# EAGLE design M452x2015 (EAGLE 6.6.0)
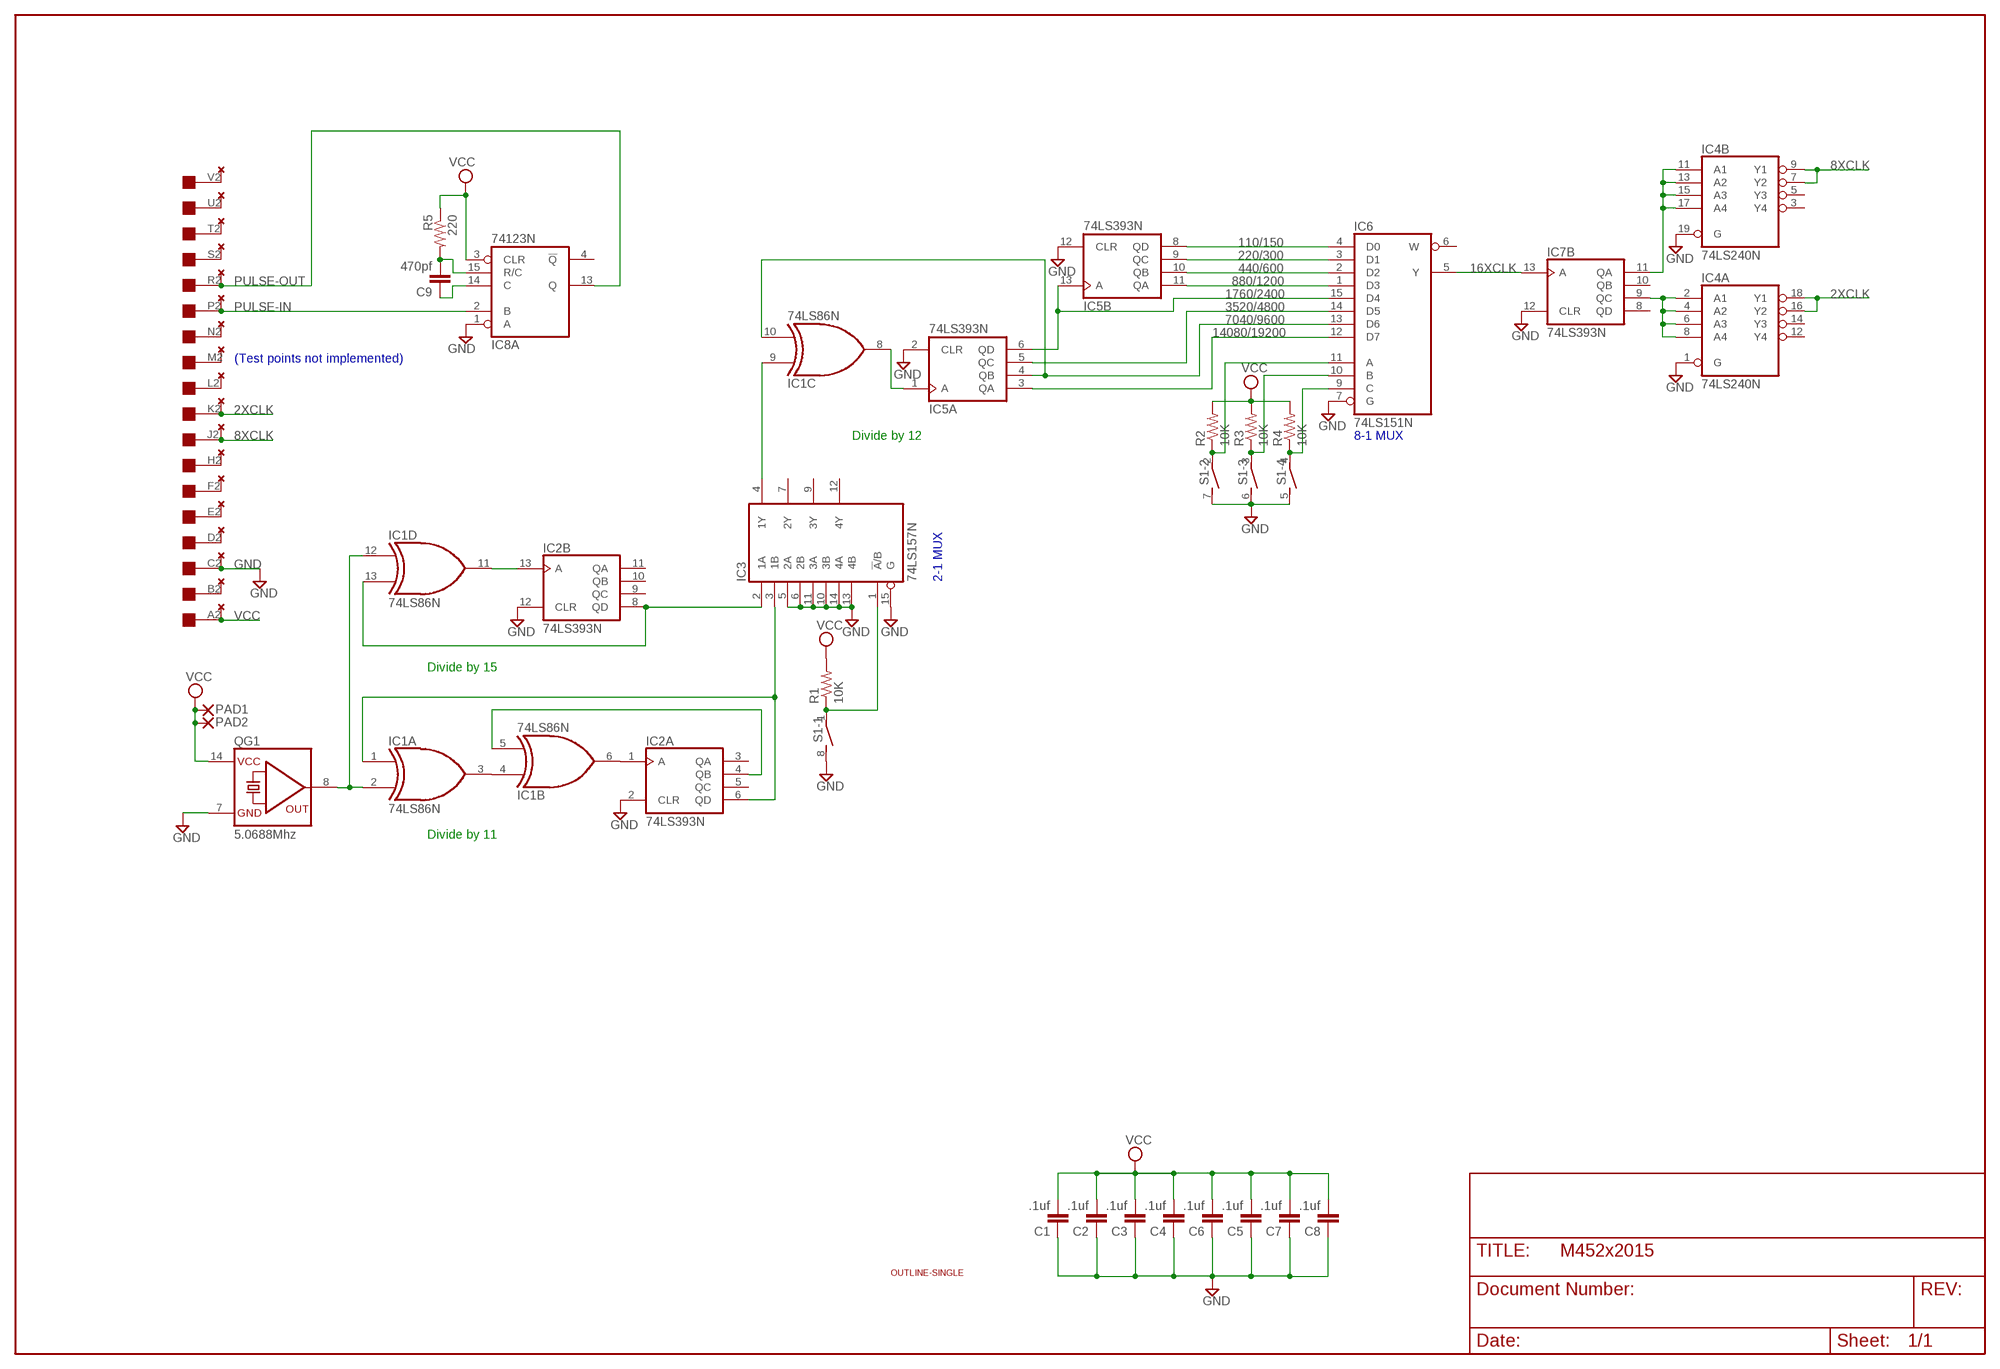
[diagram p0: schematic, sheet 1]

## Parts
C1  .1uf  C-EU050-025X075  [C050-025X075]
C2  .1uf  C-EU050-025X075  [C050-025X075]
C3  .1uf  C-EU050-025X075  [C050-025X075]
C4  .1uf  C-EU050-025X075  [C050-025X075]
C5  .1uf  C-EU050-025X075  [C050-025X075]
C6  .1uf  C-EU050-025X075  [C050-025X075]
C7  .1uf  C-EU050-025X075  [C050-025X075]
C8  .1uf  C-EU050-025X075  [C050-025X075]
C9  470pf  C-EU050-025X075  [C050-025X075]
IC1  74LS86N  [DIL14]
IC2  74LS393N  [DIL14]
IC3  74LS157N  [DIL16]
IC4  74LS240N  [DIL20]
IC5  74LS393N  [DIL14]
IC6  74LS151N  74151N  [DIL16]
IC7  74LS393N  [DIL14]
IC8  74123N  [DIL16]
PAD1  1,6/0,8  [1,6/0,8]
PAD2  1,6/0,8  [1,6/0,8]
QG1  5.0688Mhz  QG5860  [DIL14S]
R1  10K  R-US_0204/7  [0204/7]
R2  10K  R-US_0204/7  [0204/7]
R3  10K  R-US_0204/7  [0204/7]
R4  10K  R-US_0204/7  [0204/7]
R5  220  R-US_0204/7  [0204/7]
S1  DIP04S  [DIP04S]
U$1  OUTLINE-SINGLE  [SINGLE]
U$2  EDGE-1  [EDGE-CON1]
U$3  THRU-HOLE1  [THRU-HOLE1]

## Nets
2XCLK: IC4.16(A:Y2) IC4.18(A:Y1) U$2.K2 U$3.K2
8XCLK: IC4.7(B:Y2) IC4.9(B:Y1) U$2.J2 U$3.J2
16XCLK: IC6.5(Y) IC7.13(B:A)
110/150: IC5.8(B:QD) IC6.4(D0)
220/300: IC5.9(B:QC) IC6.3(D1)
440/600: IC5.10(B:QB) IC6.2(D2)
880/1200: IC5.11(B:QA) IC6.1(D3)
1760/2400: IC5.6(A:QD) IC5.13(B:A) IC6.15(D4)
3520/4800: IC5.5(A:QC) IC6.14(D5)
7040/9600: IC1.10(C:I1) IC5.4(A:QB) IC6.13(D6)
14080/19200: IC5.3(A:QA) IC6.12(D7)
GND [supply]: C1.1 C2.1 C3.1 C4.1 C5.1 C6.1 C7.1 C8.1 IC2.2(A:CLR) IC2.12(B:CLR) IC3.5(2A) IC3.6(2B) IC3.10(3B) IC3.11(3A) IC3.13(4B) IC3.14(4A) IC3.15(G) IC4.1(A:G) IC4.19(B:G) IC5.2(A:CLR) IC5.12(B:CLR) IC6.7(G) IC7.12(B:CLR) IC8.1(A:A) QG1.7(GND) S1.5 S1.6 S1.7 S1.8 U$2.C2 U$3.C2
N$1: IC1.2(A:I1) IC1.12(D:I0) QG1.8(OUT)
N$2: IC1.13(D:I1) IC2.8(B:QD) IC3.2(1A)
N$3: IC1.1(A:I0) IC2.6(A:QD) IC3.3(1B)
N$4: U$2.H2 U$3.H2
N$5: U$2.L2 U$3.L2
N$6: IC1.11(D:O) IC2.13(B:A)
N$7: IC1.6(B:O) IC2.1(A:A)
N$8: IC6.11(A) R2.1 S1.2
N$9: IC1.9(C:I0) IC3.4(1Y)
N$10: IC4.2(A:A1) IC4.4(A:A2) IC4.6(A:A3) IC4.8(A:A4) IC7.9(B:QC)
N$11: IC1.8(C:O) IC5.1(A:A)
N$12: IC4.11(B:A1) IC4.13(B:A2) IC4.15(B:A3) IC4.17(B:A4) IC7.11(B:QA)
N$13: IC6.10(B) R3.1 S1.3
N$14: IC6.9(C) R4.1 S1.4
N$15: IC1.3(A:O) IC1.4(B:I0)
N$16: U$2.M2 U$3.M2
N$17: IC3.1(!A!/B) R1.1 S1.1
N$18: U$2.N2 U$3.N2
N$19: IC1.5(B:I1) IC2.4(A:QB)
N$20: U$2.F2 U$3.F2
N$21: C9.2 IC8.15(A:R/C) R5.2
N$22: C9.1 IC8.14(A:C)
N$23: U$2.E2 U$3.E2
N$24: U$2.D2 U$3.D2
N$25: U$2.S2 U$3.S2
N$26: U$2.B2 U$3.B2
N$27: U$2.T2 U$3.T2
N$28: U$2.U2 U$3.U2
N$29: U$2.V2 U$3.V2
PULSE-IN: IC8.2(A:B) U$2.P2 U$3.P2
PULSE-OUT: IC8.13(A:Q) U$2.R2 U$3.R2
VCC [supply]: C1.2 C2.2 C3.2 C4.2 C5.2 C6.2 C7.2 C8.2 IC8.3(A:CLR) PAD1.1(P) PAD2.1(P) QG1.14(VCC) R1.2 R2.2 R3.2 R4.2 R5.1 U$2.A2 U$3.A2
Unconnected: IC2.3(A:QA) IC2.5(A:QC) IC2.9(B:QC) IC2.10(B:QB) IC2.11(B:QA) IC3.7(2Y) IC3.9(3Y) IC3.12(4Y) IC4.3(B:Y4) IC4.5(B:Y3) IC4.12(A:Y4) IC4.14(A:Y3) IC6.6(W) IC7.1(A:A) IC7.2(A:CLR) IC7.3(A:QA) IC7.4(A:QB) IC7.5(A:QC) IC7.6(A:QD) IC7.8(B:QD) IC7.10(B:QB) IC8.4(A:!Q) IC8.5(B:Q) IC8.6(B:C) IC8.7(B:R/C) IC8.9(B:A) IC8.10(B:B) IC8.11(B:CLR) IC8.12(B:!Q)

## Notes on the sheet
- (Test points not implemented)
- Divide by 12 | 8-1 MUX
- 2-1 MUX
- Divide by 15
- Divide by 11

## Power pins joined to a net without a drawn wire
GND: IC1.7(P:GND) IC2.7(P:GND) IC3.8(GND) IC4.10(P:GND) IC5.7(P:GND) IC6.8(GND) IC7.7(P:GND) IC8.8(P:GND)
VCC: IC1.14(P:VCC) IC2.14(P:VCC) IC3.16(VCC) IC4.20(P:VCC) IC5.14(P:VCC) IC6.16(VCC) IC7.14(P:VCC) IC8.16(P:VCC)

## Library data of the parts
C1-C9 = rcl:C-EU: CAPACITOR, European symbol
IC1 = 74xx-us:74*86: Quad 2-input EXCLUSIV-OR (XOR) gate
IC2 IC5 IC7 = 74xx-us:74*393: Dual 4-bit decade and binary COUNTER
IC3 = 74xx-us:74*157: Quadruple 2-line to 1-line data SELECTOR/MULTIPLEXER
IC4 = 74xx-us:74*240: Octal BUFFER and LINE DRIVER, 3-state
IC6 = 74xx-us:74*151: Data SELECTOR/MULTIPLEXER
IC8 = 74xx-us:74*123: Retriggerable monostable MULTIVIBRATOR
PAD1 PAD2 = wirepad:1,6/0,8: THROUGH-HOLE PAD
QG1 = crystal:QG5860: CRYSTAL RESONATOR
R1-R5 = rcl:R-US_: RESISTOR, American symbol
S1 = switch-dil:DIP04S: DIL/CODE SWITCH
U$1 = dec-con:OUTLINE-*: Board outlines for DEC boards.
U$2 = dec-con:EDGE-1: Single-Sided DEC Edge Connector -- (side 2)
U$3 = dec-con:THRU-HOLE1: Thru-Hole addition to double-sided edge connector.

## Net classes
1 supply: width 0.813 mm

## Board
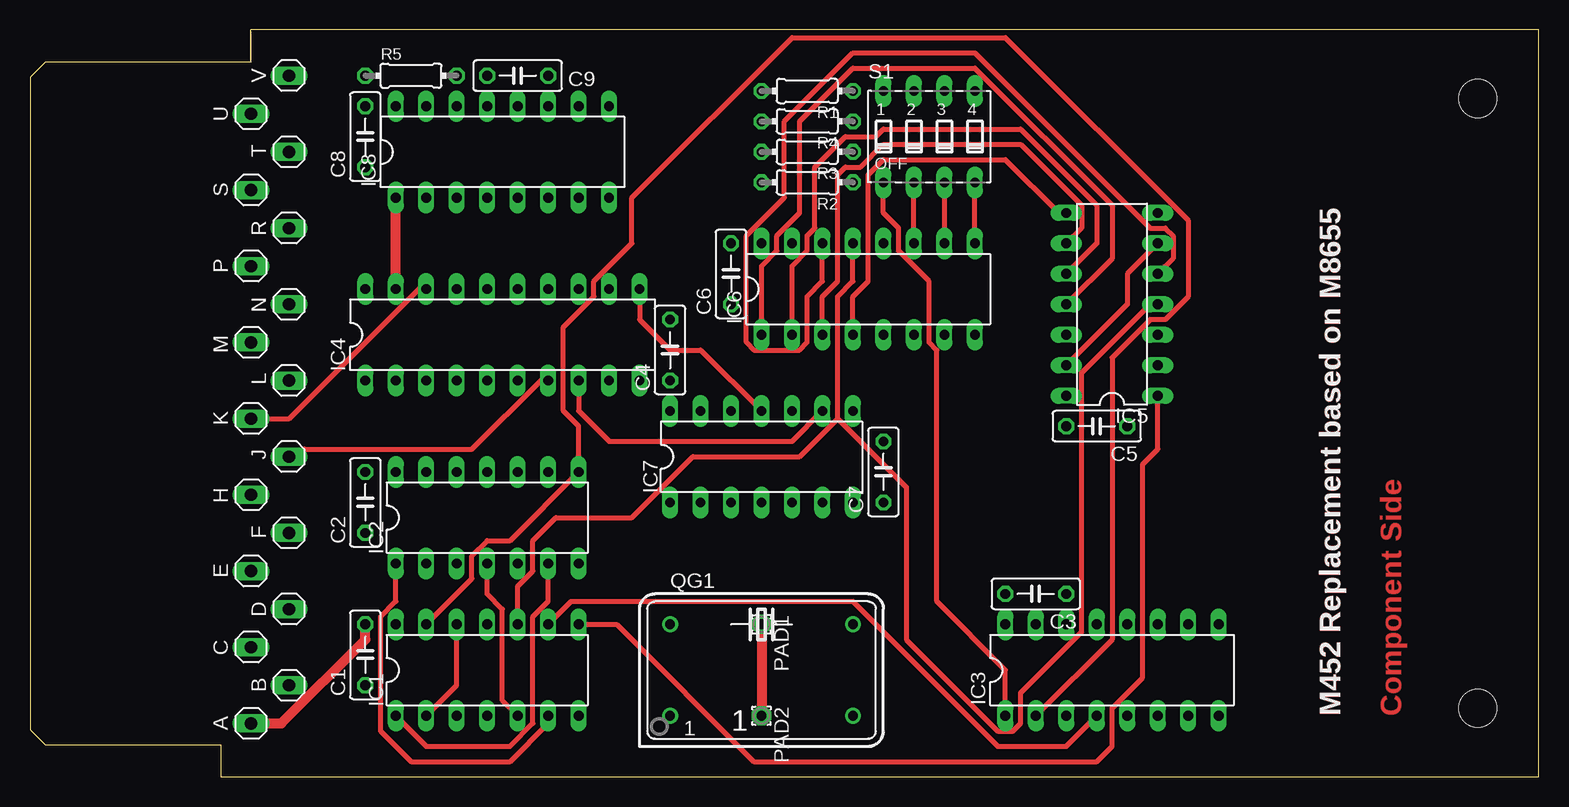
[diagram p1: board, top side]
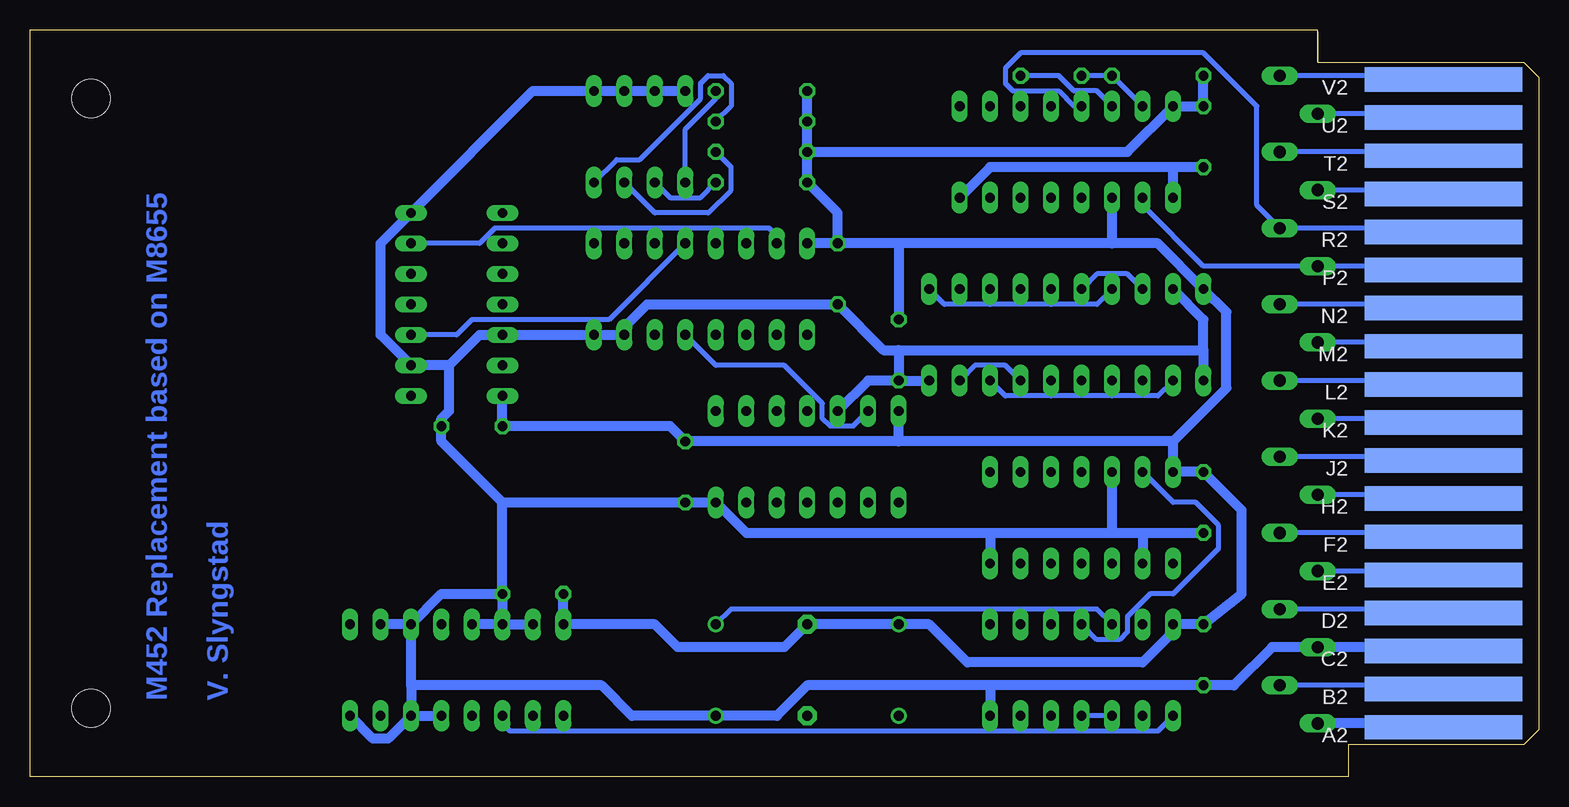
[diagram p2: board, bottom side, seen from below]

Size 125.73 x 62.23 mm. Coordinates in mm from the lower left corner, seen from the top.
Copper layers (1+16): Top 0.035mm / dielectric 1.5mm / Bottom 0.035mm
Design rules "16mils": minimum track width 16mil, minimum drill 32mil, track to track 15mil, track to pad 10mil, pad to pad 10mil, via to via 10mil, smd to smd 10mil, copper to edge 13mil, drill to drill 10mil, minimum pad ring 10mil, minimum via ring 8mil, stop-mask expansion 0mil, vias tented up to drill 0mil, thermal gap 10mil

### Footprints (pad centres in the part's own frame; a part is rotated, then mirrored left to right if it is on the bottom)
C050-025X075 = drill 0.813 octagon: 1 -2.54,0; 2 2.54,0
DIL14 = drill 0.813 long: 1 -7.62,-3.81; 2 -5.08,-3.81; 3 -2.54,-3.81; 4 0,-3.81; 5 2.54,-3.81; 6 5.08,-3.81; 7 7.62,-3.81; 8 7.62,3.81; 9 5.08,3.81; 10 2.54,3.81; 11 0,3.81; 12 -2.54,3.81; 13 -5.08,3.81; 14 -7.62,3.81
DIL16 = drill 0.813 long: 1 -8.89,-3.81; 2 -6.35,-3.81; 3 -3.81,-3.81; 4 -1.27,-3.81; 5 1.27,-3.81; 6 3.81,-3.81; 7 6.35,-3.81; 8 8.89,-3.81; 9 8.89,3.81; 10 6.35,3.81; 11 3.81,3.81; 12 1.27,3.81; 13 -1.27,3.81; 14 -3.81,3.81; 15 -6.35,3.81; 16 -8.89,3.81
DIL20 = drill 0.813 long: 1 -11.43,-3.81; 2 -8.89,-3.81; 3 -6.35,-3.81; 4 -3.81,-3.81; 5 -1.27,-3.81; 6 1.27,-3.81; 7 3.81,-3.81; 8 6.35,-3.81; 9 8.89,-3.81; 10 11.43,-3.81; 11 11.43,3.81; 12 8.89,3.81; 13 6.35,3.81; 14 3.81,3.81; 15 1.27,3.81; 16 -1.27,3.81; 17 -3.81,3.81; 18 -6.35,3.81; 19 -8.89,3.81; 20 -11.43,3.81
1,6/0,8 = drill 0.813 pad 1.6 octagon: 1 0,0
DIL14S = drill 0.813: 1 -7.62,-3.81; 7 7.62,-3.81; 8 7.62,3.81; 14 -7.62,3.81
0204/7 = drill 0.813 octagon: 1 -3.81,0; 2 3.81,0
DIP04S = drill 0.813 long: 1 -3.81,-3.81; 2 -1.27,-3.81; 3 1.27,-3.81; 4 3.81,-3.81; 5 3.81,3.81; 6 1.27,3.81; 7 -1.27,3.81; 8 -3.81,3.81
SINGLE = hole 3.175: 120.65,56.515; 120.65,5.715
EDGE-CON1 = smd 13.106 x 2.032 bottom: A2 7.938,4.128; B2 7.938,7.303; C2 7.938,10.477; D2 7.938,13.652; E2 7.938,16.828; F2 7.938,20.003; H2 7.938,23.177; J2 7.938,26.352; K2 7.938,29.527; L2 7.938,32.703; M2 7.938,35.877; N2 7.938,39.053; P2 7.938,42.227; R2 7.938,45.403; S2 7.938,48.578; T2 7.938,51.752; U2 7.938,54.928; V2 7.938,58.102
THRU-HOLE1 = drill 1.016 long: A2 28.575,3.175; B2 25.4,6.35; C2 22.225,3.175; D2 19.05,6.35; E2 15.875,3.175; F2 12.7,6.35; H2 9.525,3.175; J2 6.35,6.35; K2 3.175,3.175; L2 0,6.35; M2 -3.175,3.175; N2 -6.35,6.35; P2 -9.525,3.175; R2 -12.7,6.35; S2 -15.875,3.175; T2 -19.05,6.35; U2 -22.225,3.175; V2 -25.4,6.35

### Placement (x,y rotation side)
C1  27.94,10.16 90 top
C2  27.94,22.86 90 top
C3  83.82,15.24 180 top
C4  53.34,35.56 90 top
C5  88.9,29.21 180 top
C6  58.42,41.91 90 top
C7  71.12,25.4 90 top
C8  27.94,53.34 90 top
C9  40.64,58.42 180 top
IC1  38.1,8.89 0 top
IC2  38.1,21.59 0 top
IC3  90.17,8.89 0 top
IC4  39.37,36.83 0 top
IC5  90.17,39.37 90 top
IC6  69.85,40.64 0 top
IC7  60.96,26.67 0 top
IC8  39.37,52.07 0 top
PAD1  60.96,12.7 270 top
PAD2  60.96,5.08 270 top
QG1  60.96,8.89 0 top
R1  64.77,57.15 180 top
R2  64.77,49.53 180 top
R3  64.77,52.07 180 top
R4  64.77,54.61 180 top
R5  31.75,58.42 0 top
S1  74.93,53.34 0 top
U$1  0,0 0 top
U$2  0,0 0 top
U$3  15.24,33.02 270 top

### Tracks (layer width: path | path; a pad name or v marks a point on that pad's centre or on a via)
2XCLK
  Top 0.406: IC4.18 32.39,40.64 21.59,29.84 U$3.K2
  Bottom 0.406: IC4.16 36.83,41.91 34.29,41.91 IC4.18 | U$3.K2 13.97,29.84 U$2.K2
8XCLK
  Top 0.406: IC4.7 42.55,33.02 36.83,27.3 22.86,27.3 22.23,26.67 U$3.J2
  Bottom 0.406: IC4.9 46.99,34.29 44.45,34.29 IC4.7 | U$3.J2 13.97,26.67 U$2.J2
16XCLK
  Bottom 0.406: IC7.13 57.15,29.21 59.06,29.21 59.69,29.84 59.69,31.11 62.87,34.29 68.58,34.29 IC6.5
110/150
  Top 0.406: IC6.4 68.58,40.01 69.85,41.27 69.85,50.16 71.12,51.44 81.28,51.44 85.73,46.99 IC5.8
220/300
  Top 0.406: IC6.3 66.04,40.01 67.31,41.27 67.31,50.16 67.95,50.8 69.22,50.8 71.12,52.7 82.55,52.7 87.63,47.62 87.63,45.72 IC5.9
440/600
  Top 0.406: IC6.2 63.5,42.55 64.77,43.81 64.77,45.09 65.41,45.72 65.41,50.8 67.95,53.34 70.49,53.34 71.12,53.98 82.55,53.98 88.9,47.62 88.9,44.45 IC5.10
880/1200
  Top 0.406: IC6.1 60.96,42.55 62.23,43.81 62.23,45.09 64.14,46.99 64.14,54.61 68.58,59.05 78.74,59.05 90.17,47.62 90.17,43.18 IC5.11
1760/2400
  Top 0.406: IC5.13 91.44,39.37 91.44,41.91 IC5.6
  Bottom 0.406: IC5.6 88.27,44.45 87,45.72 64.14,45.72 63.5,45.09 IC6.15
3520/4800
  Top 0.406: IC6.14 66.04,41.27 64.77,40.01 64.77,36.2 64.14,35.56 60.33,35.56 59.69,36.2 59.69,45.09 62.87,48.26 62.87,54.61 68.58,60.33 78.74,60.33 93.35,45.72 94.62,45.72 95.25,45.09 95.25,43.18 IC5.5
7040/9600
  Top 0.406: 67.31,29.84 64.14,26.67 55.25,26.67 50.17,21.59 43.82,21.59 41.91,19.68 41.91,17.14 40.64,15.88 IC1.10 | 67.31,29.84 67.31,40.01 68.58,41.27 IC6.13 | 67.31,29.84 73.03,24.13 73.03,11.43 80.65,3.81 81.92,3.81 82.55,4.45 82.55,6.99 87.63,12.06 87.63,33.66 93.35,39.37 IC5.4
14080/19200
  Bottom 0.406: IC6.12 77.47,38.1 88.9,38.1 90.17,36.83 IC5.3
GND
  Top 0.813: IC4.19 IC8.1
  Bottom 0.813: S1.8 S1.7 S1.6 S1.5 83.82,57.15 IC5.7 96.52,44.45 96.52,36.83 IC5.2 90.81,34.29 | 90.81,34.29 90.81,30.48 91.44,29.84 C5.1 91.44,27.94 86.36,22.86 | 90.81,34.29 88.27,36.83 IC5.12 IC6.8 IC6.7 76.2,37.47 74.3,39.37 C6.1 54.61,35.56 53.34,35.56 | IC8.1 30.48,50.8 | IC8.8 45.72,50.8 30.48,50.8 | C8.1 30.48,50.8 | 27.94,35.56 27.94,38.1 IC4.19 | 27.94,35.56 IC4.1 | C4.1 IC4.10 | IC7.12 55.88,33.02 C4.1 | 53.34,35.56 C4.1 | 53.34,35.56 27.94,35.56 | 45.72,7.62 IC1.7 | 45.72,7.62 C1.1 25.4,7.62 22.23,10.79 U$3.C2 13.97,10.79 U$2.C2 | 45.72,7.62 60.96,7.62 63.5,5.08 QG1.7 75.57,5.08 78.11,7.62 93.98,7.62 | 33.02,20.32 C2.1 | 33.02,20.32 IC2.2 | 35.56,20.32 IC2.12 | 45.72,20.32 35.56,20.32 | 35.56,20.32 33.02,20.32 | 45.72,20.32 IC2.7 | IC3.6 IC3.5 | IC3.6 95.89,3.17 97.16,3.17 IC3.8 | IC3.11 IC3.10 | IC3.14 IC3.15 | C3.1 IC3.14 | IC3.14 IC3.13 | C3.1 86.36,22.86 | 86.36,22.86 C7.1 IC7.7 66.04,20.32 45.72,20.32 | IC3.11 91.44,15.24 C3.1 | 93.98,7.62 IC3.6 | 93.98,7.62 IC3.11
N$1
  Top 0.406: IC1.2 35.56,7.62 IC1.12
  Bottom 0.406: QG1.8 67.31,13.97 36.83,13.97 IC1.12
N$2
  Top 0.406: IC1.13 36.83,16.51 36.83,18.41 38.1,19.68 40.01,19.68 IC2.8 45.72,29.21 44.45,30.48 44.45,37.47 46.99,40.01 46.99,41.27 50.17,44.45 50.17,48.26 63.5,61.59 81.28,61.59 96.52,46.35 96.52,40.01 94.62,38.1 93.35,38.1 90.17,34.92 90.17,11.43 IC3.2
N$3
  Top 0.406: IC2.6 43.18,14.61 41.91,13.34 41.91,4.45 40.01,2.54 33.02,2.54 IC1.1
  Bottom 0.406: IC3.3 86.36,4.45 85.73,3.81 31.75,3.81 IC1.1
N$4
  Bottom 0.406: U$3.H2 13.97,23.5 U$2.H2
N$5
  Bottom 0.406: U$3.L2 13.97,33.02 U$2.L2
N$6
  Bottom 0.406: IC1.11 36.83,11.43 34.93,11.43 34.29,12.06 34.29,13.34 32.39,15.24 30.48,15.24 26.67,19.05 26.67,20.95 28.58,22.86 30.48,22.86 IC2.13
N$7
  Top 0.406: IC1.6 43.18,4.45 40.01,1.27 31.75,1.27 29.21,3.81 29.21,13.34 30.48,14.61 IC2.1
N$8
  Top 0.406: IC6.11 S1.2
  Bottom 0.406: R2.1 69.85,48.26 72.39,48.26 S1.2
N$9
  Top 0.406: IC1.9 45.09,14.61 68.58,14.61 80.65,2.54 86.36,2.54 IC3.4
N$10
  Top 0.406: IC7.9 63.5,27.94 48.26,27.94 45.72,30.48 IC4.8
  Bottom 0.406: 35.56,31.75 31.75,31.75 IC4.2 | 35.56,31.75 IC4.4 | 35.56,31.75 40.64,31.75 | 40.64,31.75 IC4.6 | 40.64,31.75 44.45,31.75 IC4.8
N$11
  Top 0.406: IC1.8 48.9,12.7 60.33,1.27 88.9,1.27 90.17,2.54 90.17,5.71 92.71,8.26 92.71,26.04 93.98,27.3 IC5.1
N$12
  Top 0.406: IC7.11 55.88,35.56 53.34,35.56 50.8,38.1 IC4.11
  Bottom 0.406: 40.64,39.37 36.83,39.37 IC4.17 | 40.64,39.37 IC4.15 | 40.64,39.37 45.72,39.37 | 45.72,39.37 IC4.13 | 45.72,39.37 49.53,39.37 IC4.11
N$13
  Top 0.406: S1.3 IC6.10
  Bottom 0.406: R3.1 67.31,50.8 67.31,48.9 69.22,46.99 73.66,46.99 S1.3
N$14
  Top 0.406: IC6.9 S1.4
  Bottom 0.406: R4.1 67.31,55.88 67.31,57.78 67.95,58.42 69.22,58.42 69.85,57.78 69.85,56.52 74.93,51.44 76.84,51.44 S1.4
N$15
  Bottom 0.406: IC1.3 IC1.4
N$16
  Bottom 0.406: U$3.M2 13.97,36.2 U$2.M2
N$17
  Top 0.406: IC3.1 81.28,8.89 75.57,14.61 75.57,35.56 74.93,36.2 74.93,41.27 72.39,43.81 72.39,45.72 71.12,46.99 S1.1
  Bottom 0.406: R1.1 68.58,56.52 71.12,53.98 S1.1
N$18
  Bottom 0.406: U$3.N2 13.97,39.37 U$2.N2
N$19
  Top 0.406: IC1.5 39.37,6.35 39.37,13.97 38.1,15.24 IC2.4
N$20
  Bottom 0.406: U$3.F2 13.97,20.32 U$2.F2
N$21
  Bottom 0.406: IC8.15 R5.2 C9.2
N$22
  Bottom 0.406: IC8.14 36.83,57.15 38.74,57.15 40.01,58.42 C9.1
N$23
  Bottom 0.406: U$3.E2 13.97,17.14 U$2.E2
N$24
  Bottom 0.406: U$3.D2 13.97,13.97 U$2.D2
N$25
  Bottom 0.406: U$3.S2 13.97,48.9 U$2.S2
N$26
  Bottom 0.406: U$3.B2 13.97,7.62 U$2.B2
N$27
  Bottom 0.406: U$3.T2 13.97,52.07 U$2.T2
N$28
  Bottom 0.406: U$3.U2 13.97,55.24 U$2.U2
N$29
  Bottom 0.406: U$3.V2 13.97,58.42 U$2.V2
PULSE-IN
  Bottom 0.406: IC8.2 33.02,47.62 27.94,42.55 U$3.P2 13.97,42.55 U$2.P2
PULSE-OUT
  Bottom 0.406: U$2.R2 13.97,45.72 U$3.R2 23.5,47.62 23.5,55.88 27.94,60.33 43.18,60.33 44.45,59.05 44.45,57.78 43.82,57.15 40.01,57.15 38.74,55.88 IC8.13
VCC
  Top 0.813: PAD1.1 PAD2.1 | U$3.A2 20.96,4.45 27.94,11.43 C1.2
  Bottom 0.813: 35.56,44.45 31.75,44.45 IC4.20 26.04,38.73 26.04,32.38 30.48,27.94 | 35.56,44.45 IC8.3 | 53.34,44.45 C4.2 | 53.34,44.45 C6.2 | C6.2 IC6.16 | R5.1 C8.2 IC8.16 34.29,52.07 R3.2 | R3.2 R2.2 58.42,46.99 C6.2 | R3.2 R4.2 R1.2 | 35.56,44.45 53.34,44.45 | IC5.14 C5.2 72.39,29.21 C7.2 53.34,27.94 | 53.34,27.94 IC7.14 | 30.48,27.94 53.34,27.94 | 30.48,27.94 IC2.14 C2.2 24.77,22.23 24.77,15.24 C1.2 IC1.14 30.48,12.06 33.02,9.53 47.63,9.53 50.8,12.7 QG1.14 PAD1.1 62.87,10.79 71.76,10.79 73.66,12.7 IC3.16 C3.2 | U$3.A2 13.97,4.45 U$2.A2

### Text on the board
Top: M452 Replacement based on M8655 | Component Side
Bottom: V. Slyngstad | M452 Replacement based on M8655
tPlace: 1
tNames: M452 Replacement based on M8655